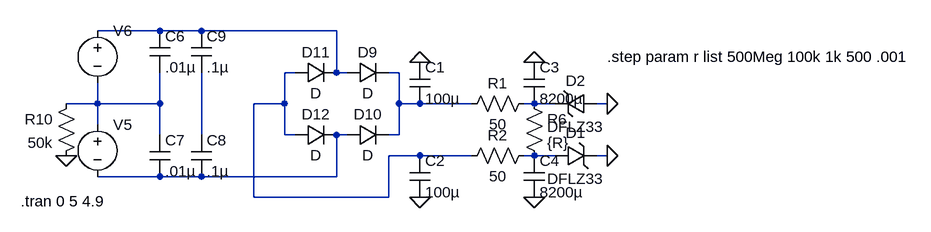
[diagram p0: schematic Power Supply.asc]
Power Supply.asc, the LTspice schematic file:
Version 4
SHEET 1 1544 680
WIRE -1040 32 -1136 32
WIRE -976 32 -1040 32
WIRE -768 32 -976 32
WIRE -832 96 -848 96
WIRE -768 96 -768 32
WIRE -752 96 -768 96
WIRE -672 96 -688 96
WIRE -1136 144 -1136 112
WIRE -1136 144 -1184 144
WIRE -1040 144 -1040 96
WIRE -1040 144 -1136 144
WIRE -848 144 -848 96
WIRE -848 144 -896 144
WIRE -672 144 -672 96
WIRE -640 144 -672 144
WIRE -560 144 -640 144
WIRE -464 144 -480 144
WIRE -432 144 -464 144
WIRE -352 144 -368 144
WIRE -1136 176 -1136 144
WIRE -1040 192 -1040 144
WIRE -976 192 -976 96
WIRE -848 192 -848 144
WIRE -832 192 -848 192
WIRE -752 192 -768 192
WIRE -672 192 -672 144
WIRE -672 192 -688 192
WIRE -640 224 -688 224
WIRE -560 224 -640 224
WIRE -464 224 -480 224
WIRE -432 224 -464 224
WIRE -352 224 -368 224
WIRE -1040 256 -1136 256
WIRE -976 256 -1040 256
WIRE -768 256 -768 192
WIRE -768 256 -976 256
WIRE -896 288 -896 144
WIRE -688 288 -688 224
WIRE -688 288 -896 288
FLAG -1184 224 0
FLAG -640 80 0
FLAG -640 288 0
FLAG -352 144 0
FLAG -352 224 0
FLAG -464 80 0
FLAG -464 288 0
SYMBOL diode -752 112 R270
WINDOW 0 32 32 VTop 0
WINDOW 3 0 32 VBottom 0
SYMATTR InstName D9
SYMBOL diode -752 208 R270
WINDOW 0 32 32 VTop 0
WINDOW 3 0 32 VBottom 0
SYMATTR InstName D10
SYMBOL res -480 128 R0
SYMATTR InstName R6
SYMATTR Value {R}
SYMBOL voltage -1136 160 R0
WINDOW 3 24 104 Invisible 0
WINDOW 123 0 0 Left 0
WINDOW 39 0 0 Left 0
SYMATTR InstName V5
SYMATTR Value SINE(0 43 60)
SYMBOL voltage -1136 16 R0
WINDOW 3 24 104 Invisible 0
WINDOW 123 0 0 Left 0
WINDOW 39 0 0 Left 0
SYMATTR InstName V6
SYMATTR Value SINE(0 43 60)
SYMBOL diode -832 112 R270
WINDOW 0 32 32 VTop 0
WINDOW 3 0 32 VBottom 0
SYMATTR InstName D11
SYMBOL diode -832 208 R270
WINDOW 0 32 32 VTop 0
WINDOW 3 0 32 VBottom 0
SYMATTR InstName D12
SYMBOL res -1168 128 M0
SYMATTR InstName R10
SYMATTR Value 50k
SYMBOL cap -1056 32 R0
SYMATTR InstName C6
SYMATTR Value .01µ
SYMBOL cap -1056 192 R0
SYMATTR InstName C7
SYMATTR Value .01µ
SYMBOL cap -992 192 R0
SYMATTR InstName C8
SYMATTR Value .1µ
SYMBOL cap -992 32 R0
SYMATTR InstName C9
SYMATTR Value .1µ
SYMBOL cap -656 80 R0
SYMATTR InstName C1
SYMATTR Value 100µ
SYMBOL cap -656 224 R0
SYMATTR InstName C2
SYMATTR Value 100µ
SYMBOL zener -432 240 R270
WINDOW 0 36 32 VTop 0
WINDOW 3 -4 32 VBottom 0
SYMATTR InstName D1
SYMATTR Value DFLZ33
SYMATTR Description Diode
SYMATTR Type diode
SYMBOL zener -368 128 R90
WINDOW 0 -4 32 VBottom 0
WINDOW 3 36 32 VTop 0
SYMATTR InstName D2
SYMATTR Value DFLZ33
SYMATTR Description Diode
SYMATTR Type diode
SYMBOL res -464 128 R90
WINDOW 0 0 56 VBottom 0
WINDOW 3 32 56 VTop 0
SYMATTR InstName R1
SYMATTR Value 50
SYMBOL res -464 208 R90
WINDOW 0 0 56 VBottom 0
WINDOW 3 32 56 VTop 0
SYMATTR InstName R2
SYMATTR Value 50
SYMBOL cap -480 80 R0
SYMATTR InstName C3
SYMATTR Value 8200µ
SYMBOL cap -480 224 R0
SYMATTR InstName C4
SYMATTR Value 8200µ
TEXT -1254 294 Left 0 !.tran 0 5 4.9
TEXT -352 72 Left 0 !.step param r list 500Meg 100k 1k 500 .001

The netlist it stands for:
* Power Supply.asc
D9 N001 N003 D
D10 N007 N003 D
R6 N005 N008 {R}
V5 N004 N007 SINE(0 43 60)
V6 N001 N004 SINE(0 43 60)
D11 N002 N001 D
D12 N002 N007 D
R10 N004 0 50k
C6 N001 N004 .01µ
C7 N004 N007 .01µ
C8 N006 N007 .1µ
C9 N001 N006 .1µ
C1 0 N003 100µ
C2 N002 0 100µ
D1 N008 0 DFLZ33
D2 0 N005 DFLZ33
R1 N005 N003 50
R2 N008 N002 50
C3 0 N005 8200µ
C4 N008 0 8200µ
.model D D
.lib standard.dio
.tran 0 5 4.9
.step param r list 500Meg 100k 1k 500 .001
.backanno
.end